# Altium schematic sheet DuinoTag.SchDoc
size A
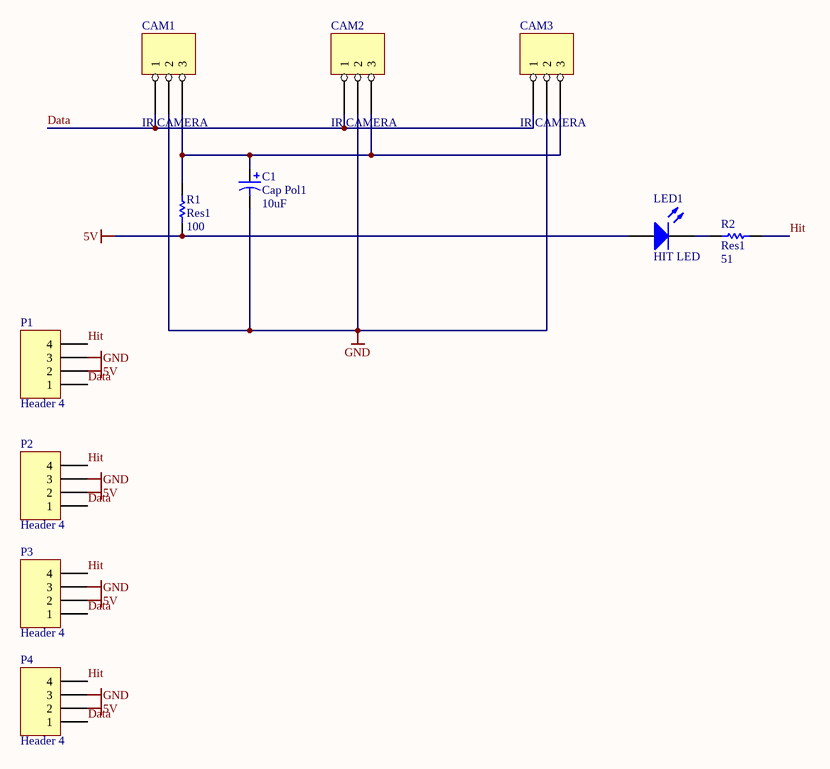
[diagram p0: DuinoTag.SchDoc]

## Parts
C1  Cap Pol1  value 10uF  [94SP-C]
CAM1  IR CAMERA  [SIP3]
CAM2  IR CAMERA  [SIP3]
CAM3  IR CAMERA  [SIP3]
LED1  HIT LED  [Type 5mm]
P1  Header 4  [HDR1X4]
P2  Header 4  [HDR1X4]
P3  Header 4  [HDR1X4]
P4  Header 4  [HDR1X4]
R1  Res1  value 100  [AXIAL-0.3]
R2  Res1  value 51  [AXIAL-0.3]

## Nets
5V: LED1.1(A) P1.2 P2.2 P3.2 P4.2 R1.1
GND: C1.2 CAM1.2 CAM2.2 CAM3.2 P1.3 P2.3 P3.3 P4.3
Data: CAM1.1 CAM2.1 CAM3.1 P1.1 P2.1 P3.1 P4.1
Hit: P1.4 P2.4 P3.4 P4.4 R2.1
NetC1_1: C1.1 CAM1.3 CAM2.3 CAM3.3 R1.2
NetLED1_2: LED1.2(K) R2.2

## Library data of the parts
C1 = Cap Pol1: Polarized Capacitor (Radial); Published: 8-Jun-2000; LatestRevisionDate: 17-Jul-2002; LatestRevisionNote: Re-released for DXP Platform.; PackageReference: RB7.6-15; Publisher: Altium Limited; PackageDescription: Polarized Capacitor (Radial); 2 Leads
CAM1-CAM3 = HEADER 3: CONN HEADR BRKWAY .100 3POS STR; Connector Type: Header, Unshrouded, Breakaway; Number of Positions: 3; Number of Positions Loaded: All; Pitch: 0.100" (2.54mm); Supplier 1: Digi-Key; RoHS: RoHS Compliant; Category: Connectors, Interconnects; Stock 1: 6661; Pricing 1: 1=0.46, 10=0.436, 50=0.3172, 100=0.3049, 250=0.27376, 500=0.2613, 1000=0.21775, 2500=0.19909, 5000=0.18665 (USD); Packaging: Bulk; Contact Type: Male Pin; Number of Rows: 1; Row Spacing: -; Contact Mating Length: 0.230" (5.84mm); Mounting Type: Through Hole; Termination: Solder; Fastening Type: -; Features: -; Contact Finish: Gold; Contact Finish Thickness: 15µin (0.38µm); Color: Black; ComponentLink1URL: http://www.te.com/commerce/DocumentDelivery/DDEController?Action=srchrtrv&DocNm=146280&DocType=Customer+Drawing&DocLang=English; ComponentLink1Description: http://www.te.com/commerce/DocumentDelivery/DDEController?Action=srchrtrv&DocNm=146280&DocType=Customer+Drawing&DocLang=English; Supplier Part Number 1: 5-146280-3-ND
LED1 = LED1: Typical RED GaAs LED; Published: 8-Jun-2000; LatestRevisionDate: 08-Jul-2005; LatestRevisionNote: Mech Layer 1 removed.; PackageReference: LED-1; Publisher: Altium Limited; PackageDescription: LED; 2 Leads
P1-P4 = Header 4: Header, 4-Pin; LatestRevisionDate: 17-Jul-2002; LatestRevisionNote: Re-released for DXP Platform.; Publisher: Altium Limited
R1 R2 = Res1: Resistor; Published: 8-Jun-2000; LatestRevisionDate: 17-Jul-2002; LatestRevisionNote: Re-released for DXP Platform.; PackageReference: AXIAL-0.3; Publisher: Altium Limited; PackageDescription: Axial Device, Thru-Hole; 2 Leads; 0.3 in Pin Spacing